# Altium schematic sheet lora.SchDoc
size A4; SheetNumber: 3; SheetTotal: 6
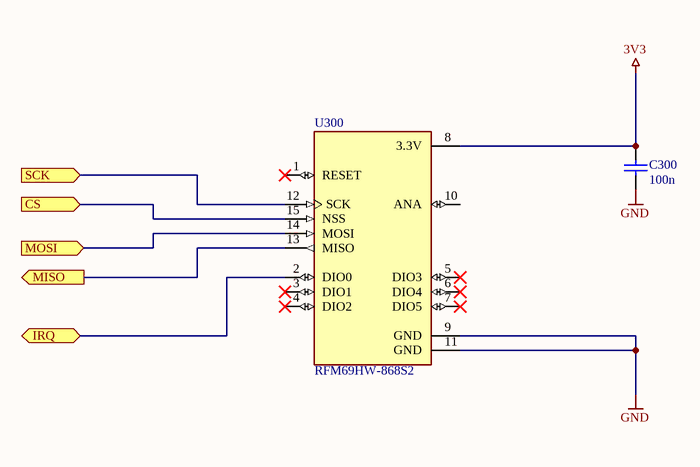
[diagram p0: lora.SchDoc]

## Parts
C300  value 100n  (hidden comment: Capacitor)
U300  RFM69HW-868S2  [XCVR_RFM69HW-868S2]

## Ports
CS (in), IRQ (bidir), MISO (out), MOSI (in), SCK (in)

## Nets
3V3: C300.2 U300.8(3.3V)
GND: C300.1 U300.9(GND) U300.11(GND)
CS: U300.15(NSS) ; port CS
IRQ: U300.2(DIO0) ; port IRQ
MISO: U300.13(MISO) ; port MISO
MOSI: U300.14(MOSI) ; port MOSI
SCK: U300.12(SCK) ; port SCK

Not connected (* = marked no-connect by the designer): U300 1(RESET)* 3(DIO1)* 4(DIO2)* 5(DIO3)* 6(DIO4)* 7(DIO5)* 10(ANA)

## Library data of the parts
C300 = Capacitor: SimulationGenericComponent: True
U300 = RFM69HW-868S2: General ISM < 1GHz Transceiver Module 868MHz Antenna Not Included Surface Mount; MF: RF; Package: SMD-16 RF Solutions; Availability: Unavailable; MP: RFM69HW-868S2; Value: *; SnapEDA_Link: https://www.snapeda.com/parts/RFM69HW-868S2/RF%20Solutions/view-part/367203/?ref=snap; Price: None